# EAGLE design openSX70-dongle_SEEED_v5 (EAGLE 9.1.0)
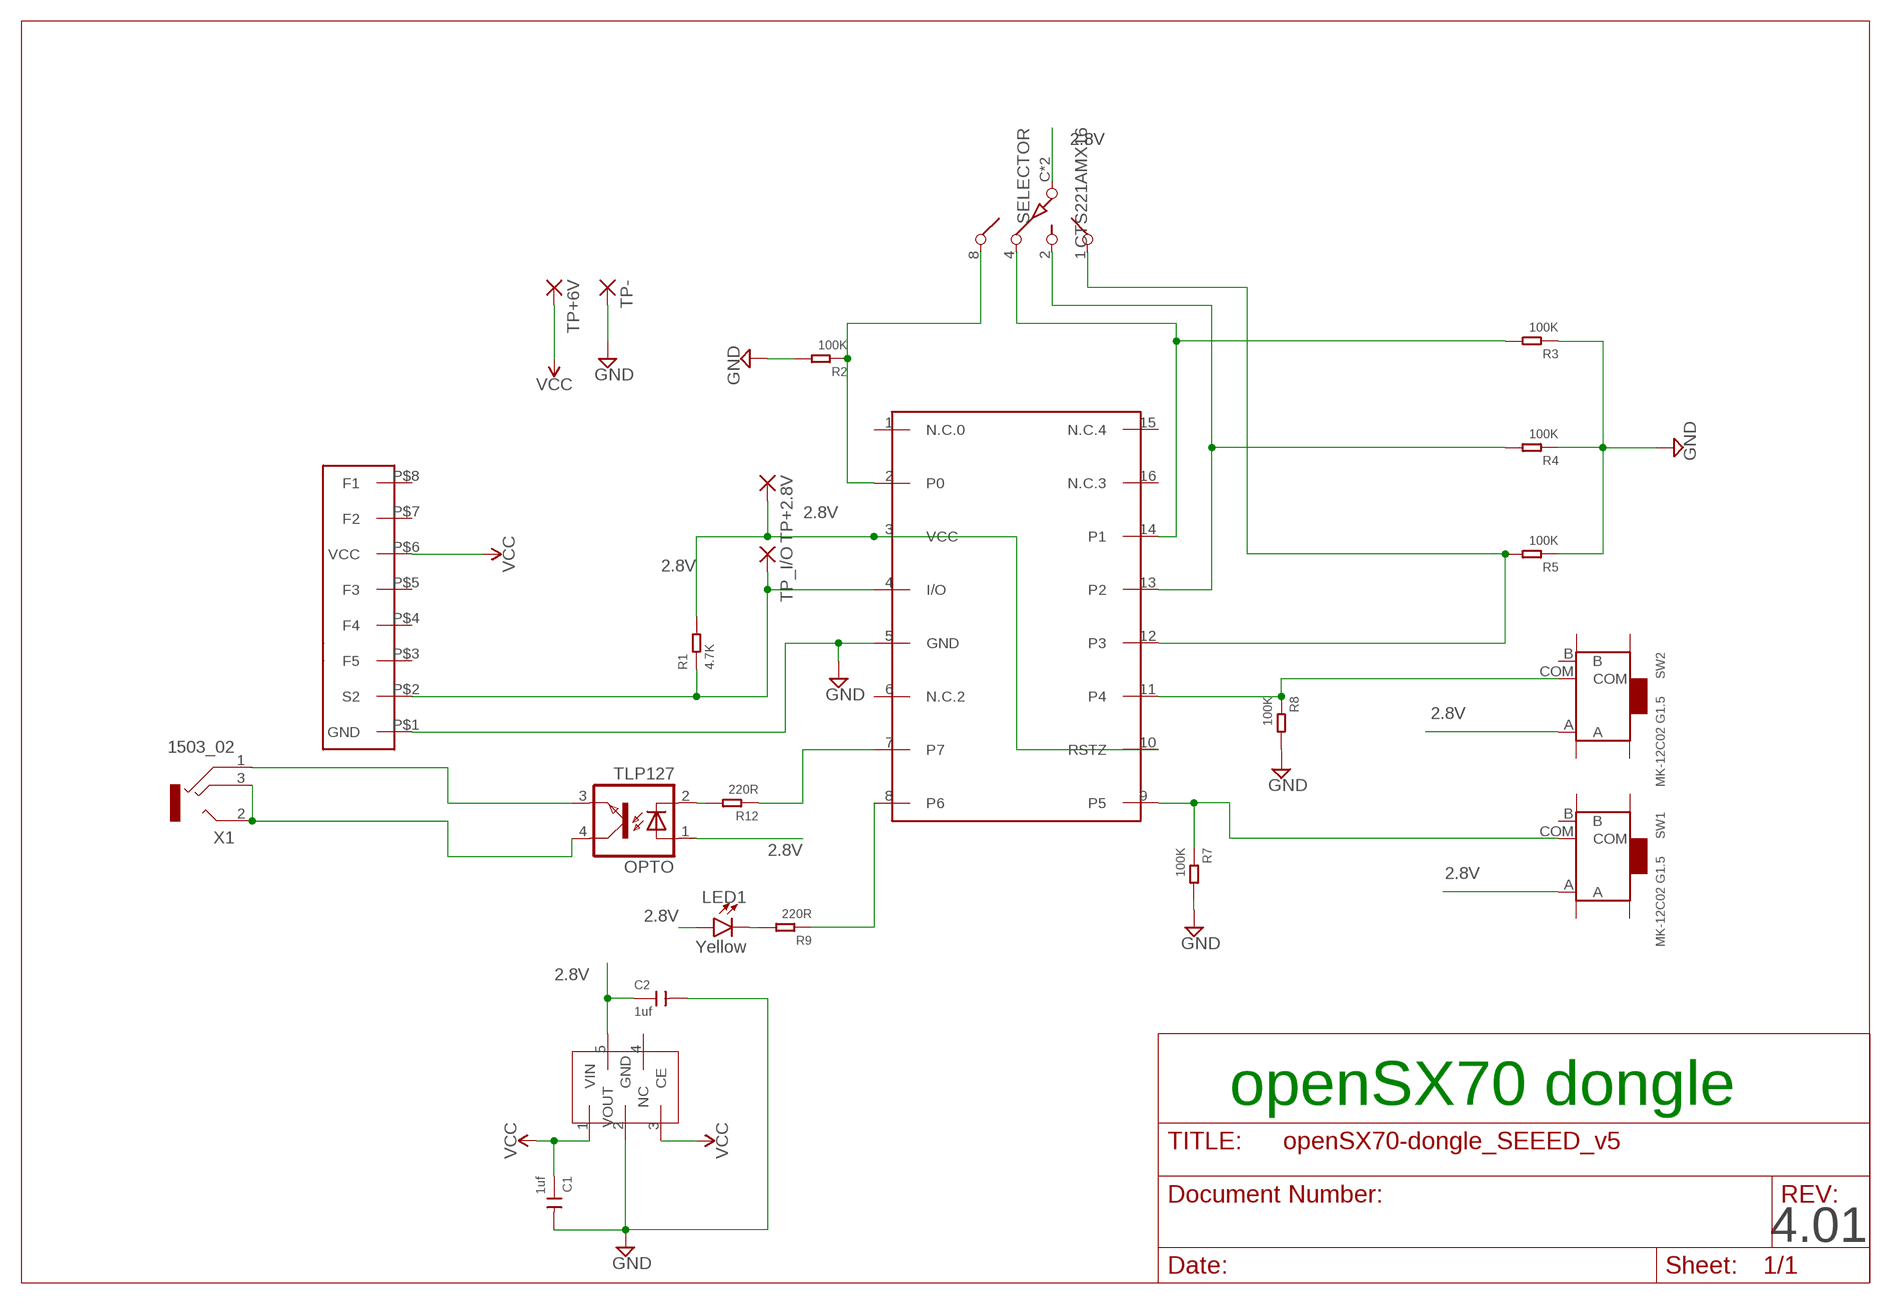
[diagram p0: schematic, sheet 1]

## Parts
C1  1uf  CERAMIC-1UF-25V-10%-X7R(0603)  [C0603]
C2  1uf  CERAMIC-1UF-25V-10%-X7R(0603)  [C0603]
DS2408  DS2408  [SO16]
LED1  Yellow  LED-YELLOWLILYPAD  [LED-1206]
OPTO  TLP127  [SO-4]
R1  4.7K  SMD-RES-4.7K-5%-1/10W(0603)  [R0603]
R2  100K  SMD-RES-100K-1%-1/10W(0603)  [R0603]
R3  100K  SMD-RES-100K-1%-1/10W(0603)  [R0603]
R4  100K  SMD-RES-100K-1%-1/10W(0603)  [R0603]
R5  100K  SMD-RES-100K-1%-1/10W(0603)  [R0603]
R7  100K  SMD-RES-100K-1%-1/10W(0603)  [R0603]
R8  100K  SMD-RES-100K-1%-1/10W(0603)  [R0603]
R9  220R  SMD-RES-220R-5%-1/10W(0603)  [R0603]
R12  220R  SMD-RES-220R-5%-1/10W(0603)  [R0603]
REG  NCP4688  [SOT-23-5]
SELECTOR  CTS221AMX16  [CTS221AMX16]
SW1  MK-12C02 G1.5  SMD-TOGGLE-SWITCH-ON-ON(3+4P-6.7X2.7MM)  [SW7-SMD-L6.7X2.7X3.2MM]
SW2  MK-12C02 G1.5  SMD-TOGGLE-SWITCH-ON-ON(3+4P-6.7X2.7MM)  [SW7-SMD-L6.7X2.7X3.2MM]
TP+2.8V  SMD2  [SMD1,27-2,54]
TP+6V  SMD2  [SMD1,27-2,54]
TP-  SMD2  [SMD1,27-2,54]
TP_I/O  SMD2  [SMD1,27-2,54]
U$1  FLASH-EDGE-CONNECTOR  [FLASH-EDGE-8]
X1  1503_02  [1503_02]

## Nets
2.8V: C2.1 DS2408.3(VCC) DS2408.10(RSTZ) LED1.A OPTO.1(A) R1.2 REG.5(VOUT) SELECTOR.C SELECTOR.C2(C) SW1.A SW2.A TP+2.8V.1(P)
GND: C1.2 C2.2 DS2408.5(GND) R2.2 R3.1 R4.1 R5.1 R7.2 R8.2 REG.2(GND) TP-.1(P) U$1.P$1(GND)
N$1: DS2408.4(I/O) R1.1 TP_I/O.1(P) U$1.P$2(S2)
N$2: LED1.C R9.2
N$3: DS2408.2(P0) R2.1 SELECTOR.8
N$4: DS2408.14(P1) R3.2 SELECTOR.4
N$5: DS2408.13(P2) R4.2 SELECTOR.2
N$6: DS2408.11(P4) R8.1 SW2.COM
N$7: DS2408.9(P5) R7.1 SW1.COM
N$8: DS2408.8(P6) R9.1
N$9: OPTO.4(COL) X1.2 X1.3
N$10: OPTO.2(C) R12.2
N$11: DS2408.7 R12.1
N$13: DS2408.12(P3) R5.2 SELECTOR.1
N$15: OPTO.3(EMIT) X1.1
VCC: C1.1 REG.1(VIN) REG.3(CE) TP+6V.1(P) U$1.P$6(VCC)
Unconnected: DS2408.1(N.C.0) DS2408.6(N.C.2) DS2408.15(N.C.4) DS2408.16(N.C.3) REG.4(NC) SW1.B SW1.SS1 SW1.SS2 SW1.SS3 SW1.SS4 SW2.B SW2.SS1 SW2.SS2 SW2.SS3 SW2.SS4 U$1.P$3(F5) U$1.P$4(F4) U$1.P$5(F3) U$1.P$7(F2) U$1.P$8(F1) X1.2@2

## Notes on the sheet
- openSX70 dongle
- 4.01

## Library data of the parts
C1 C2 = Seeed-Capacitor:CERAMIC-1UF-25V-10%-X7R(0603): 302010139; MPN: CC0603KRX7R8BB105
DS2408 = DS2408-joaco:DS2408
LED1 = SparkFun-LED:LED-YELLOW: Yellow SMD LED Used in manufacturing several products at SparkFun. Packages: 0603 - SMD 0603 package[Product Link] <http://www.kingbrightusa.com/product.asp?catalog_name=LED&product_id=APT1608SYCK> 0603 -SMART - SMART SMD 0603 package (more efficient/more expensive) [Product Link] <http://www.osram-os.com/osram_os/en/products/product-catalog/led-light-emitting-diodes/smartled-0603/ly-l29k/index.jsp> LilyPad - SMD1206 package[Product Datasheet] <https://www.sparkfun.com/datasheets/DevTools/LilyPad/Q150YUS4.pdf> SparkFun Products: Blynk Board <https://www.sparkfun.com/products/13794> IOIO-OTG <https://www.sparkfun.com/products/13613> XBee Explorer Serial <https://www.sparkfun.com/products/13225>; PROD_ID: DIO-09909
OPTO = openSX70:TLP127
R1 = Seeed-Resistor:SMD-RES-4.7K-5%-1/10W(0603): 301010290; MPN: RC0603JR-074K7L
R2-R5 R7 R8 = Seeed-Resistor:SMD-RES-100K-1%-1/10W(0603): 301010196; MPN: RC0603FR-07100KL
R9 R12 = Seeed-Resistor:SMD-RES-220R-5%-1/10W(0603): 301010163; MPN: RC0603JR-07220RL
REG = openSX70:NCP4688
SELECTOR = openSX70:CTS221AMX16
SW1 SW2 = Seeed-Switch:SMD-TOGGLE-SWITCH-ON-ON(3+4P-6.7X2.7MM): 311030001; MPN: MK-12C02 G1.5
TP+2.8V TP+6V TP- TP_I/O = wirepad:SMD2: SMD PAD
U$1 = SX70-flash:FLASH-EDGE-CONNECTOR
X1 = con-lumberg:1503_02: Jack connectors according to JISC 6560, 3.5 mm Klinkeneinbaukupplung nach JISC 6560, 3,5 mm, 3-polig/stereo, abgewinkelte Ausführung, Surface-Mount-Technik (SMT) Source: http://www.lumberg.com/Produkte/PDFs/1503_02.pdf; OC_FARNELL: 1216979; OC_NEWARK: unknown

## Net classes
0 GND: width 0.305 mm
1 VCC: width 0.254 mm
2 2.8V: width 0.254 mm

## Board
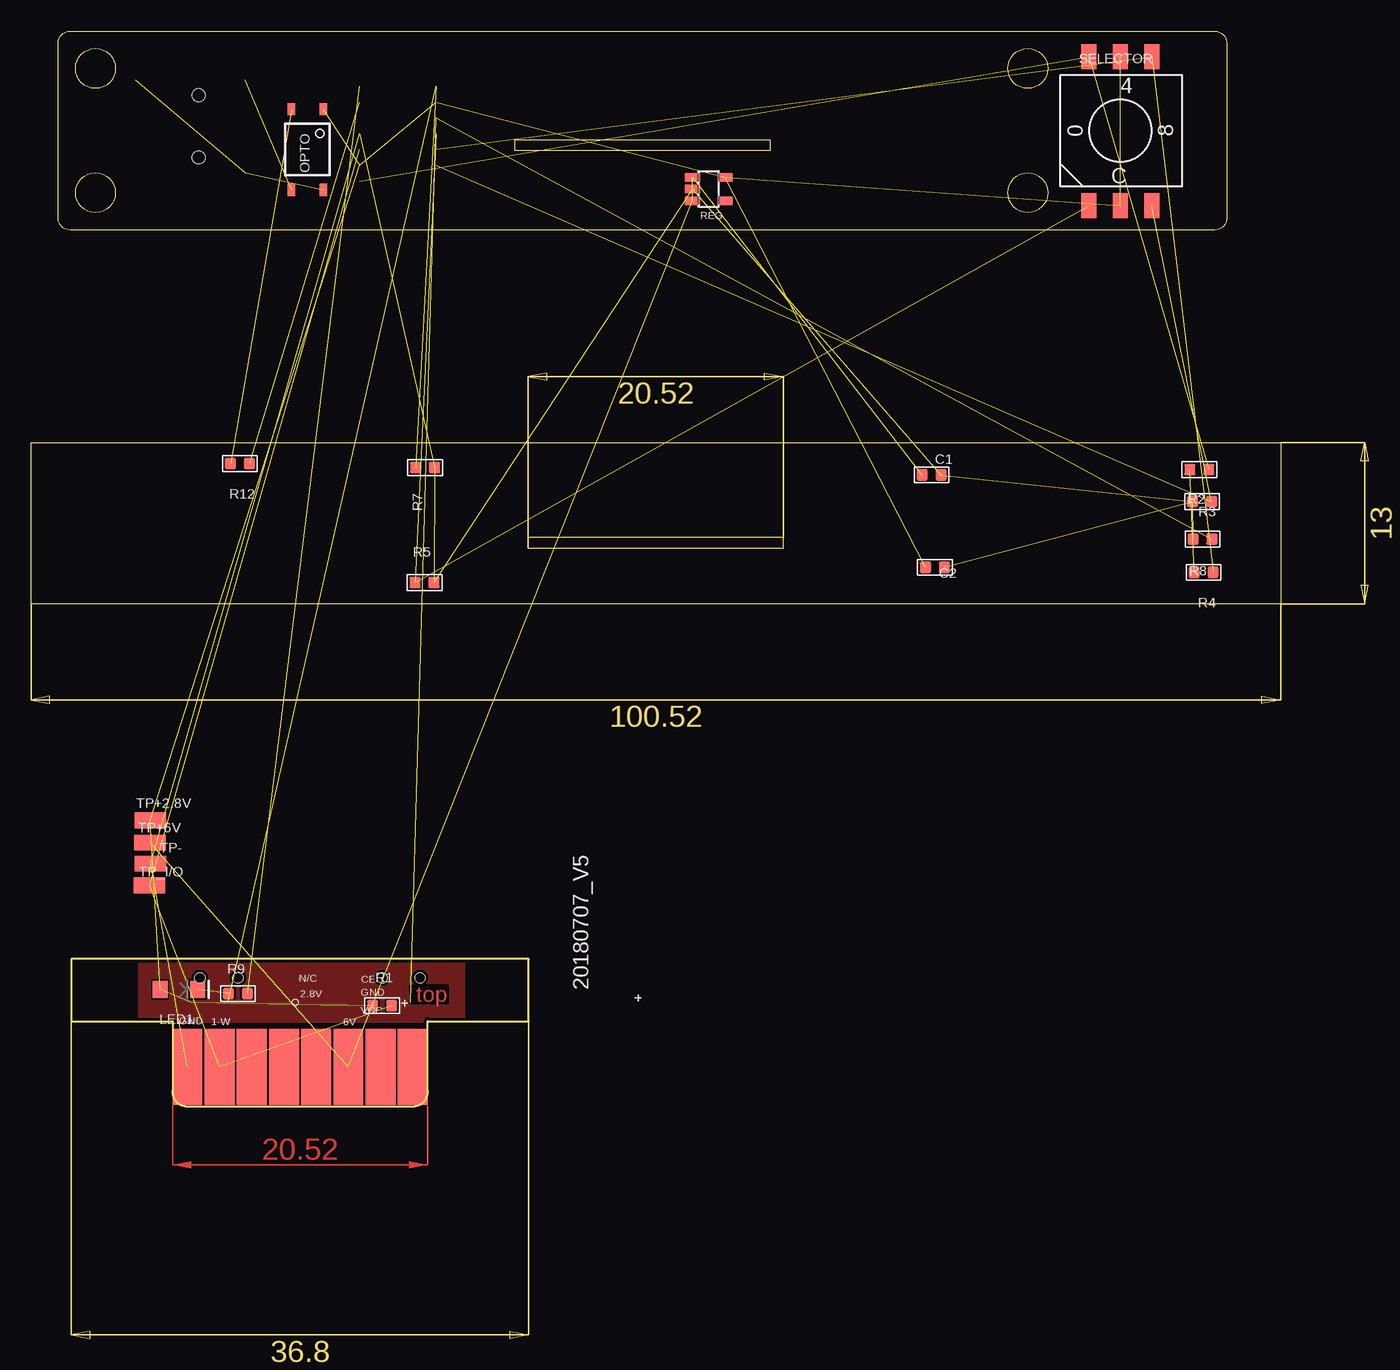
[diagram p1: board, top side]
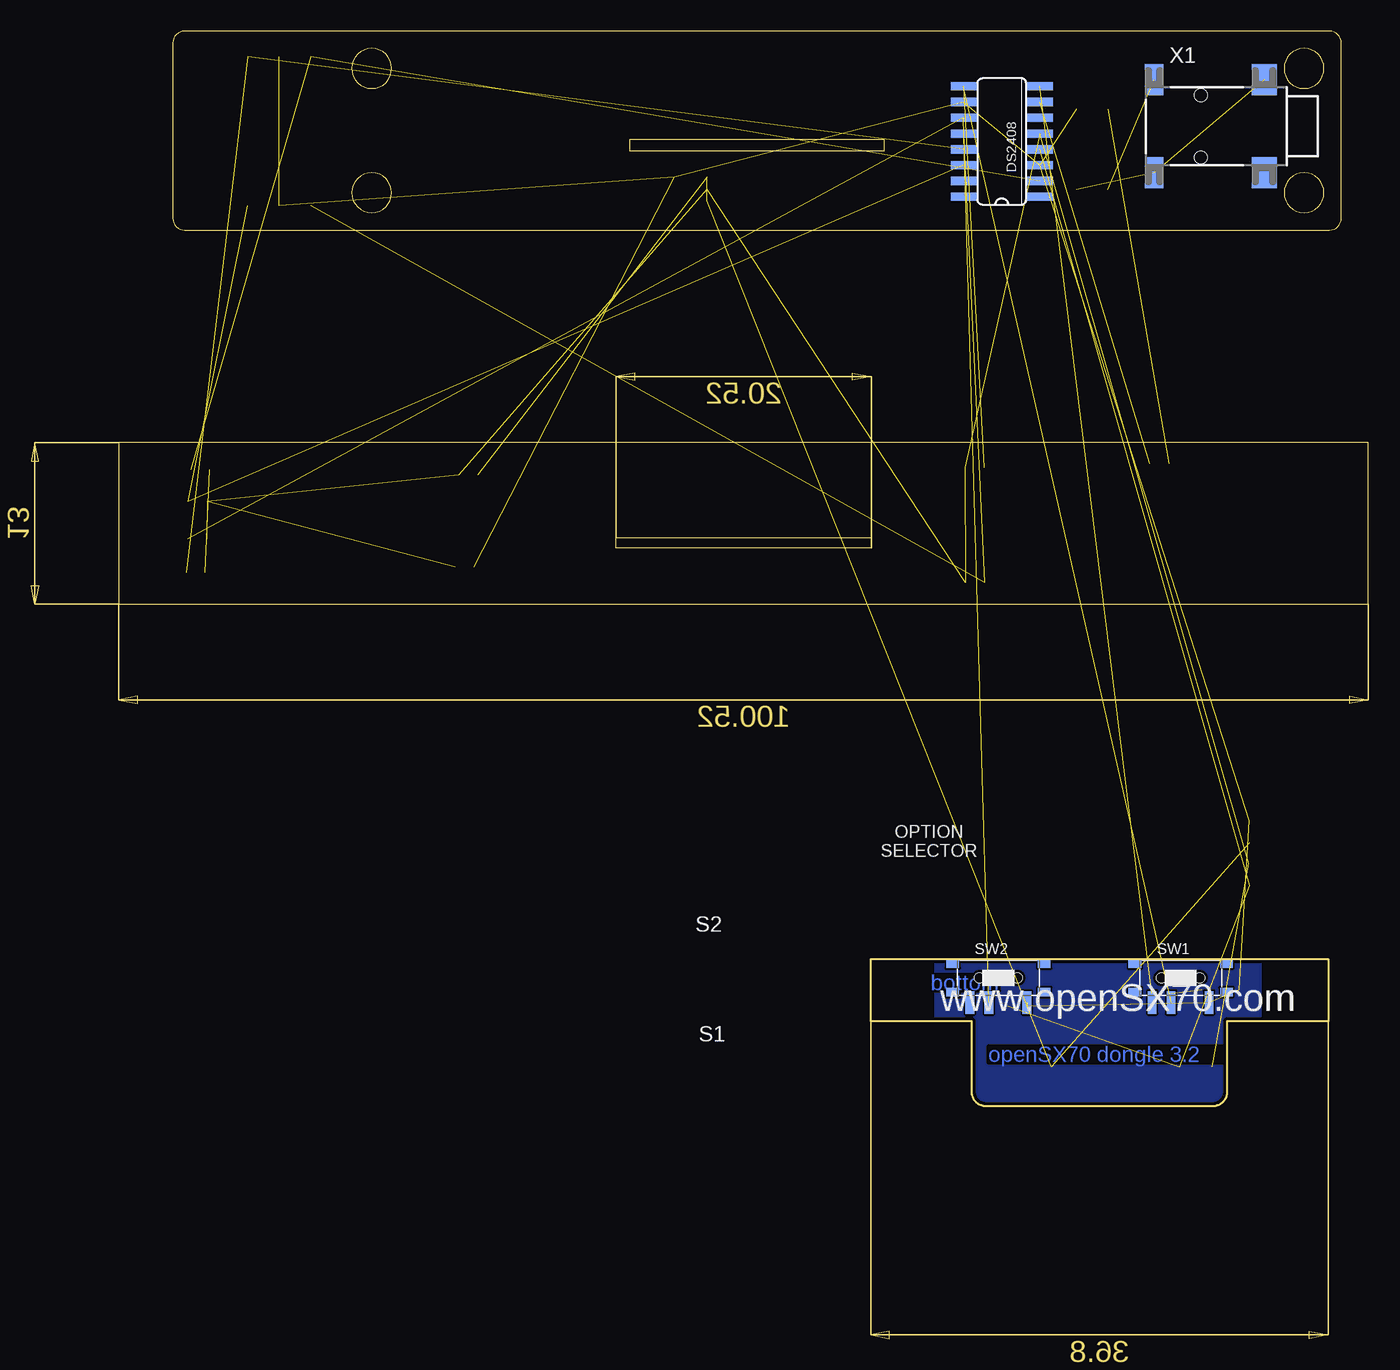
[diagram p2: board, bottom side, seen from below]

Size 100.52 x 86.48 mm. Coordinates in mm from the lower left corner, seen from the top.
Outline: 31.92,6.71 31.9,6.83
Outline: 31.9,6.83 31.9,1.24 arc-90 30.89,0 12.39,0 arc-90 11.38,1.24 11.38,6.83 3.24,6.83 3.24,11.83 40.04,11.83 40.04,6.83 31.9,6.83
Outline: 0,53.38 100.52,53.38 100.52,40.38 0,40.38 0,53.38
Outline: 40,44.88 60.52,44.88 60.52,45.73 40,45.73 40,44.88
Outline: 95.22,70.47 3.14,70.47 2.94,70.49 2.76,70.55 2.6,70.64 2.46,70.75 2.34,70.9 2.25,71.06 2.2,71.24 2.18,71.43 2.18,85.53 2.2,85.72 2.25,85.9 2.34,86.06 2.46,86.2 2.6,86.32 2.76,86.41 2.94,86.46 3.14,86.48 95.22,86.48 95.42,86.46 95.59,86.41 95.76,86.32 95.9,86.2 96.02,86.06 96.11,85.9 96.16,85.72 96.18,85.53 96.18,71.43 96.16,71.24 96.11,71.06 96.02,70.9 95.9,70.75 95.76,70.64 95.59,70.55 95.42,70.49 95.22,70.47
Outline: 38.92,77.73 59.44,77.73 59.44,76.88 38.92,76.88 38.92,77.73
Outline: 80.18,71.87 79.86,71.91 79.55,72 79.28,72.15 79.04,72.34 78.85,72.58 78.7,72.85 78.61,73.16 78.57,73.48 78.61,73.8 78.7,74.1 78.85,74.38 79.04,74.61 79.28,74.81 79.55,74.96 79.86,75.05 80.18,75.08 80.5,75.05 80.8,74.96 81.08,74.81 81.31,74.61 81.51,74.38 81.66,74.1 81.75,73.8 81.79,73.48 81.75,73.16 81.66,72.85 81.51,72.58 81.31,72.34 81.08,72.15 80.8,72 80.5,71.91 80.18,71.87
Outline: 80.18,81.87 79.86,81.91 79.55,82 79.28,82.15 79.04,82.34 78.85,82.58 78.7,82.85 78.61,83.16 78.57,83.48 78.61,83.8 78.7,84.1 78.85,84.38 79.04,84.61 79.28,84.81 79.55,84.96 79.86,85.05 80.18,85.08 80.5,85.05 80.8,84.96 81.08,84.81 81.31,84.61 81.51,84.38 81.66,84.1 81.75,83.8 81.79,83.48 81.75,83.16 81.66,82.85 81.51,82.58 81.31,82.34 81.08,82.15 80.8,82 80.5,81.91 80.18,81.87
Outline: 5.18,81.87 4.86,81.91 4.55,82 4.28,82.15 4.04,82.34 3.85,82.58 3.7,82.85 3.61,83.16 3.57,83.48 3.61,83.8 3.7,84.1 3.85,84.38 4.04,84.61 4.28,84.81 4.55,84.96 4.86,85.05 5.18,85.08 5.5,85.05 5.8,84.96 6.08,84.81 6.32,84.61 6.51,84.38 6.66,84.1 6.75,83.8 6.78,83.48 6.75,83.16 6.66,82.85 6.51,82.58 6.32,82.34 6.08,82.15 5.8,82 5.5,81.91 5.18,81.87
Outline: 5.18,71.87 4.86,71.91 4.55,72 4.28,72.15 4.04,72.34 3.85,72.58 3.7,72.85 3.61,73.16 3.57,73.48 3.61,73.8 3.7,74.1 3.85,74.38 4.04,74.61 4.28,74.81 4.55,74.96 4.86,75.05 5.18,75.08 5.5,75.05 5.8,74.96 6.08,74.81 6.32,74.61 6.51,74.38 6.66,74.1 6.75,73.8 6.78,73.48 6.75,73.16 6.66,72.85 6.51,72.58 6.32,72.34 6.08,72.15 5.8,72 5.5,71.91 5.18,71.87
Copper layers (1*16): Top 0.035mm / dielectric 1.5mm / Bottom 0.035mm
Design rules "SeeedStudio_2layer_DRU_no_angle_20140221": minimum track width 6mil, minimum drill 12mil, track to track 6mil, track to pad 6mil, pad to pad 6mil, via to via 6mil, smd to smd 0mil, copper to edge 10mil, drill to drill 10mil, minimum pad ring 10mil, minimum via ring 6mil, stop-mask expansion 2mil, vias tented up to drill 100mil, thermal gap 10mil

### Footprints (pad centres in the part's own frame; a part is rotated, then mirrored left to right if it is on the bottom)
C0603 = smd 0.889 x 0.889: 1 0,0.762; 2 0,-0.762
SO16 = smd 0.66 x 2.032: 1 -4.445,-3.073; 2 -3.175,-3.073; 3 -1.905,-3.073; 4 -0.635,-3.073; 5 0.635,-3.073; 6 1.905,-3.073; 7 3.175,-3.073; 8 4.445,-3.073; 9 4.445,3.073; 10 3.175,3.073; 11 1.905,3.073; 12 0.635,3.073; 13 -0.635,3.073; 14 -1.905,3.073; 15 -3.175,3.073; 16 -4.445,3.073
LED-1206 = smd 1.2 x 1.4: A -1.5,0; C 1.5,0
SO-4 = smd 1 x 0.6: 1 -3.24,0.635; 2 -3.24,-1.905; 3 3.24,-1.905; 4 3.24,0.635
R0603 = smd 0.889 x 0.889: 1 0,0.762; 2 0,-0.762
SOT-23-5 = smd 0.69 x 1.2: 1 -0.95,-1.3; 2 0,-1.3; 3 0.95,-1.3; 4 0.95,1.3; 5 -0.95,1.3
CTS221AMX16 = smd 2 x 1.2: 1 -6.04,2.54; 2 5.96,-2.54; 4 -6.04,-2.54; 8 5.96,2.54; C -6.04,0; C2 5.96,0; P$2 -6.04,2.54; P$3 -6.04,-2.54
SW7-SMD-L6.7X2.7X3.2MM = smd 1.8 x 0.7: A 1.978,2.286; B 1.978,-2.286; COM 1.978,-0.762 | smd 0.7 x 1.016: SS1 -1.15,-3.683; SS2 1.15,-3.683; SS3 1.15,3.683; SS4 -1.15,3.683 | hole 0.813: 0,-1.524; 0,1.524
SMD1,27-2,54 = smd 1.27 x 2.54: 1 0,0
FLASH-EDGE-8 = smd 2.4 x 6.09: P$1 -9.065,0; P$2 -6.475,0; P$3 -3.885,0; P$4 -1.295,0; P$5 1.295,0; P$6 3.885,0; P$7 6.475,0; P$8 9.065,0
1503_02 = smd 2.5 x 1.5: 1 -3.75,-10.75; 3 3.75,-10.75 | smd 2.5 x 2: 2 -3.75,-1.9; 2@2 3.75,-1.9 | hole 1: -2.5,-7; 2.5,-7

### Placement (x,y rotation side)
C1  72.45,50.78 90 top
C2  72.72,43.35 90 top
DS2408  29.49,77.6 90 bottom
LED1  11.89,9.39 0 top
OPTO  22.87,76.96 270 top
R1  28.24,8.08 270 top
R2  93.98,51.2 270 top
R3  94.2,48.63 90 top
R4  94.33,42.94 90 top
R5  31.65,42.12 270 top
R7  31.69,51.36 90 top
R8  94.24,45.61 270 top
R9  16.64,9.05 270 top
R12  16.81,51.68 270 top
REG  54.51,73.78 270 top
SELECTOR  87.64,78.47 90 top
SW1  15.11,10.32 270 bottom
SW2  29.77,10.32 270 bottom
TP+2.8V  9.6,22.99 90 top
TP+6V  9.57,21.18 90 top
TP-  9.61,19.51 90 top
TP_I/O  9.54,17.74 90 top
U$1  21.64,3.15 0 top
X1  6.49,78.83 270 bottom

### Tracks (layer width: path | path; a pad name or v marks a point on that pad's centre or on a via)
2.8V  (11 unrouted)
GND  (11 unrouted)
  pour Top: 8.69,11.79 34.85,11.84 34.85,6.76 8.69,6.71
  pour Bottom: 8.69,11.88 8.69,6.71 11.23,6.71 11.23,0.36 31.55,0.36 31.55,6.71 34.82,6.66 34.82,11.83
N$1  (3 unrouted)
N$2  (1 unrouted)
N$3  (2 unrouted)
N$4  (2 unrouted)
N$5  (2 unrouted)
N$6  (2 unrouted)
N$7  (2 unrouted)
N$8  (1 unrouted)
N$9  (2 unrouted)
N$10  (1 unrouted)
N$11  (1 unrouted)
N$13  (2 unrouted)
N$15  (1 unrouted)
VCC  (4 unrouted)
(copper drawn outside any net)
  shapes: Top area x1

### Text on the board
Top: top
Bottom: bottom | openSX70 dongle 3.2
tPlace: 20180707_V5 | + | +
bPlace: www.openSX70.com
tNames: N/C | CE | 2.8V | GND | VCC | GND | 1-W | 6V
bNames: OPTION / SELECTOR | S2 | S1